# Altium schematic sheet Connectors.SchDoc
size A3
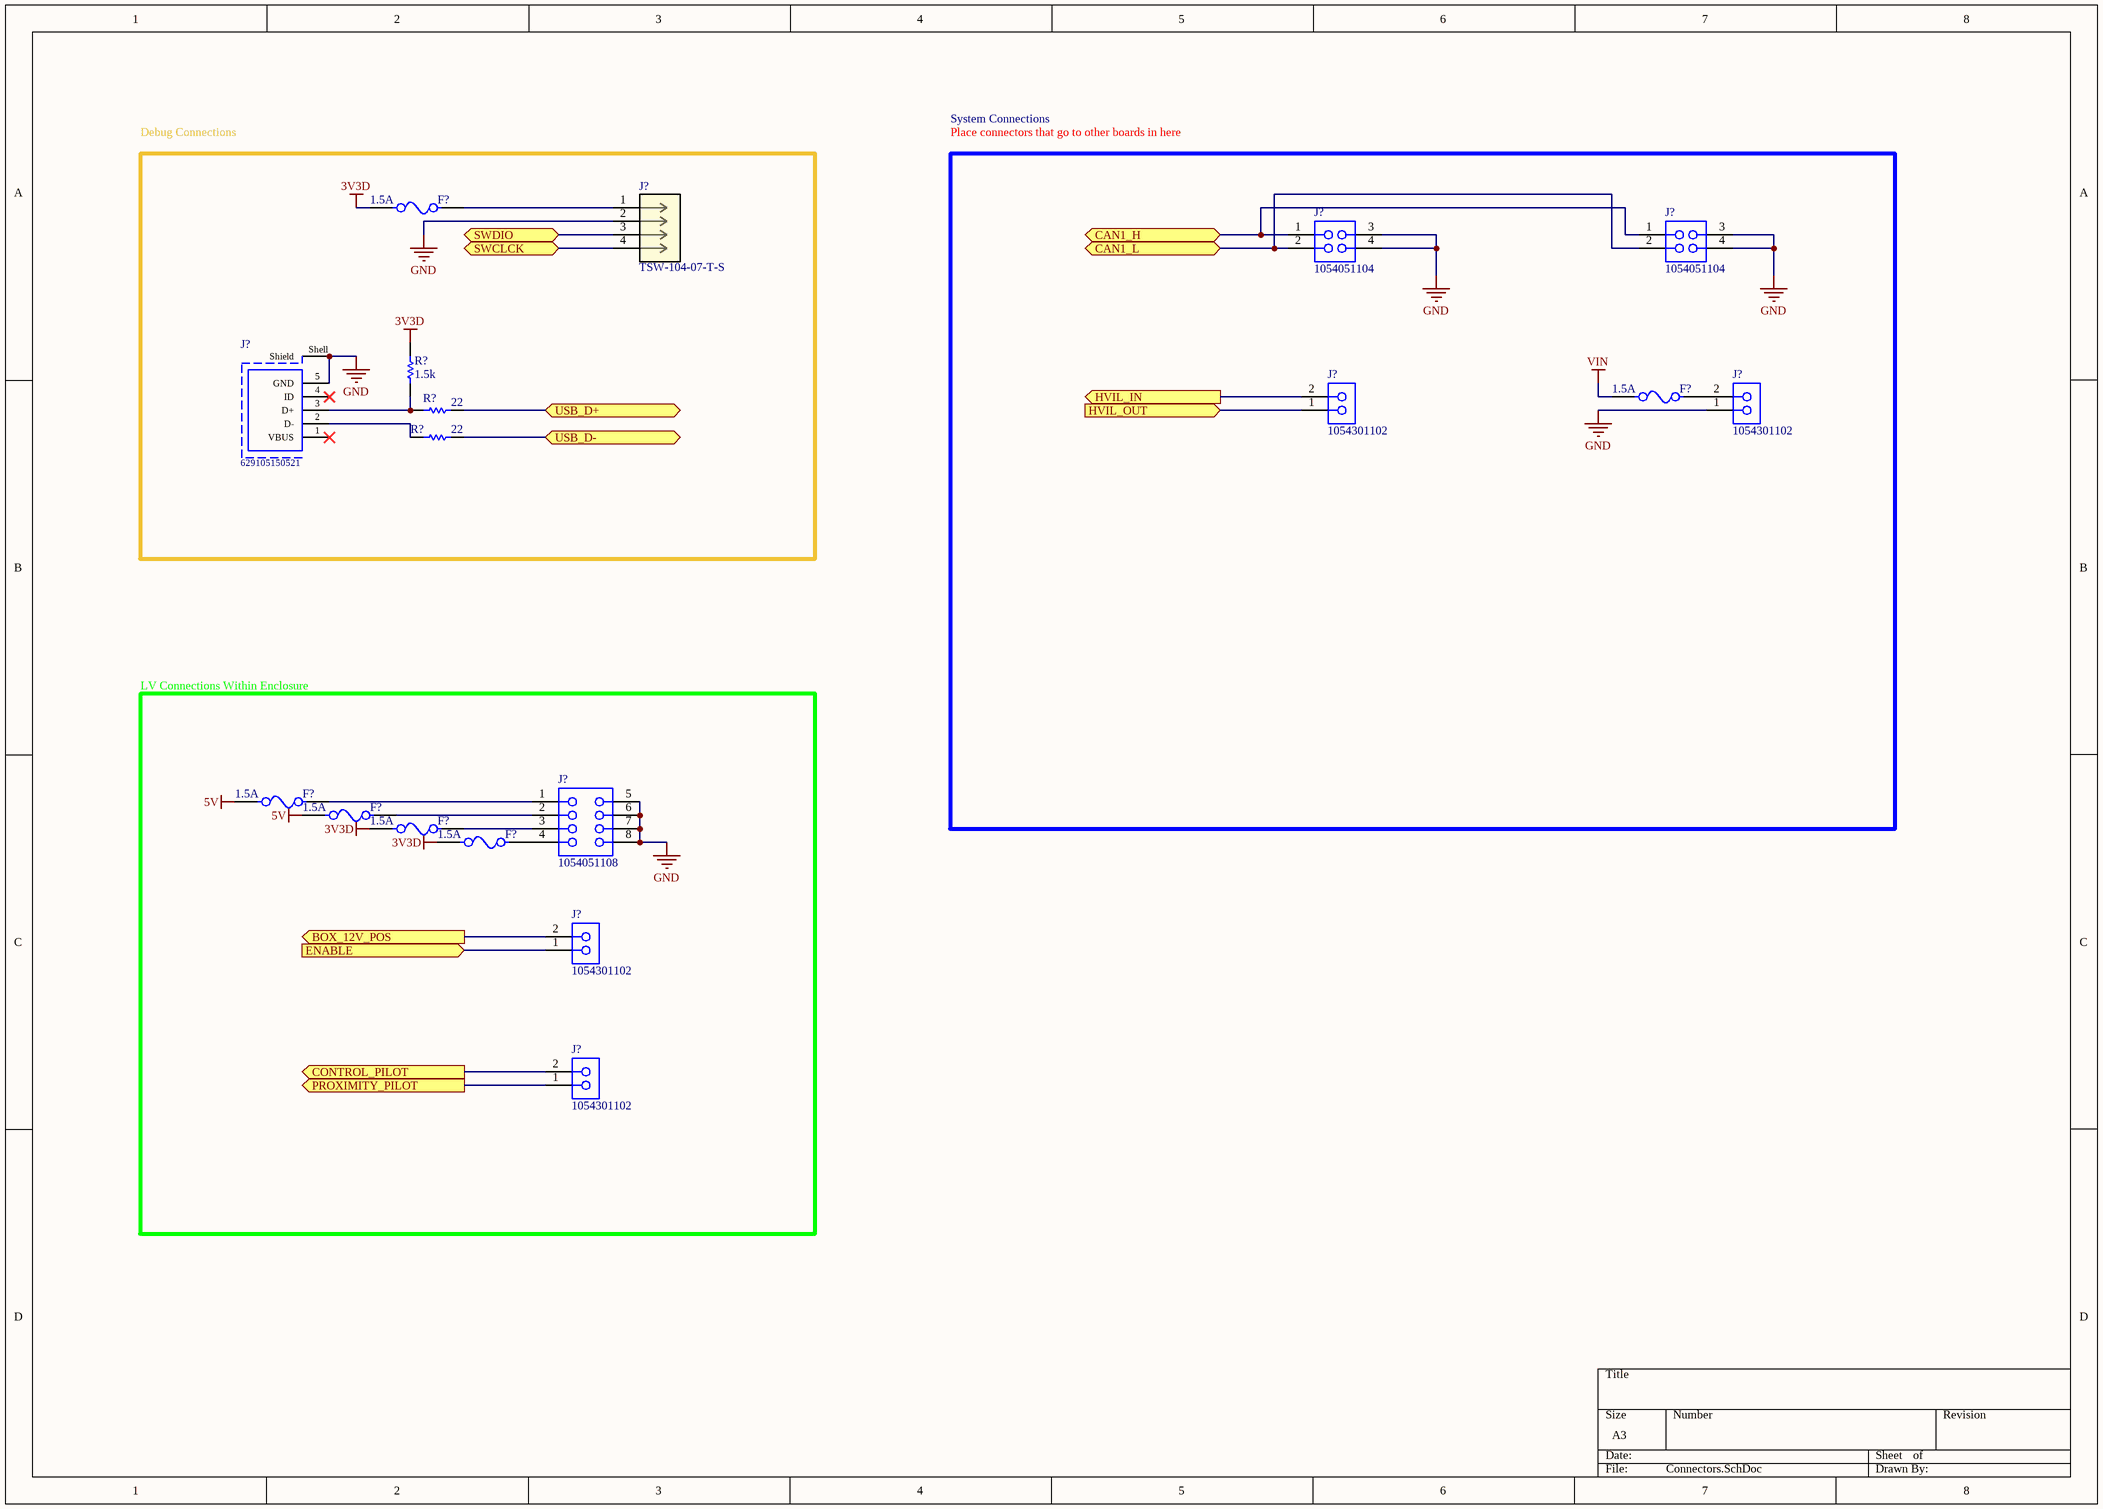
[diagram p0: Connectors.SchDoc]

## Parts
(Parts that share a designator on the sheet are numbered #1, #2 ... from top to bottom, then left to right.)
F?#1  1.5A  [FUSC1608X43N]
F?#2  1.5A  [FUSC1608X43N]
F?#3  1.5A  [FUSC1608X43N]
F?#4  1.5A  [FUSC1608X43N]
F?#5  1.5A  [FUSC1608X43N]
F?#6  1.5A  [FUSC1608X43N]
J?#1  TSW-104-07-T-S  [CON4_1X4_TU_TSW]
J?#2  1054051104  [1054051104]
J?#3  1054051104  [1054051104]
J?#4  1054301102  [1054301102]
J?#5  1054301102  [1054301102]
J?#6  629105150521  [629105150521]
J?#7  1054051108  [1054051108]
J?#8  1054301102  [1054301102]
J?#9  1054301102  [1054301102]
R?#1  1.5k  [RESC2013X50X35ML15T15]
R?#2  22  [RESC0805(2012)_L]
R?#3  22  [RESC2013X50X35ML15T15]

## Blocks framed on the sheet
Debug Connections: F?#1 J?#1 J?#6 R?#1-R?#3
Place connectors that go to other boards in here: F?#2 J?#2-J?#5
LV Connections Within Enclosure: F?#3-F?#6 J?#7-J?#9

## Ports
BOX_12V_POS (out), CAN1_H (bidir), CAN1_L (bidir), CONTROL_PILOT (out), ENABLE (in), HVIL_IN (out), HVIL_OUT (in), PROXIMITY_PILOT (out), SWCLCK (bidir), SWDIO (bidir), USB_D+ (bidir), USB_D- (bidir)

## Nets
3V3D: F?#1.1 F?#5.1 F?#6.1 R?#1.1
5V: F?#3.1 F?#4.1
GND: J?#1.2 J?#2.3 J?#2.4 J?#3.3 J?#3.4 J?#5.1 J?#6.5(GND) J?#6.Shell(Shield) J?#7.5 J?#7.6 J?#7.7 J?#7.8
VIN: F?#2.1
BOX_12V_POS: J?#8.2 ; port BOX_12V_POS
CAN1_H: J?#2.1 J?#3.1 ; port CAN1_H
CAN1_L: J?#2.2 J?#3.2 ; port CAN1_L
CONTROL_PILOT: J?#9.2 ; port CONTROL_PILOT
ENABLE: J?#8.1 ; port ENABLE
HVIL_IN: J?#4.2 ; port HVIL_IN
HVIL_OUT: J?#4.1 ; port HVIL_OUT
PROXIMITY_PILOT: J?#9.1 ; port PROXIMITY_PILOT
SWCLCK: J?#1.4 ; port SWCLCK
SWDIO: J?#1.3 ; port SWDIO
USB_D+: R?#2.1 ; port USB_D+
USB_D-: R?#3.1 ; port USB_D-
NetF?#1_2: F?#1.2 J?#1.1
NetF?#2_2: F?#2.2 J?#5.2
NetF?#3_2: F?#3.2 J?#7.1
NetF?#4_2: F?#4.2 J?#7.2
NetF?#5_2: F?#5.2 J?#7.3
NetF?#6_2: F?#6.2 J?#7.4
NetJ?#6_2: J?#6.2(D-) R?#3.2
NetJ?#6_3: J?#6.3(D+) R?#1.2 R?#2.2

Not connected (* = marked no-connect by the designer): J?#6 1(VBUS)* 4(ID)*

## Notes on the sheet
- System Connections

## Library data of the parts
F?#1-F?#6 = 046701.5NR: 1.5A 0603 Fuse; Manufacturer_Name: LITTELFUSE; Datasheet Link: https://www.littelfuse.com/~/media/electronics/datasheets/fuses/littelfuse_fuse_467_datasheet.pdf.pdf; Height: 0.432mm; Manufacturer_Part_Number: 046701.5NR; Arrow Part Number: 046701.5NR; Arrow Price/Stock: https://www.arrow.com/en/products/046701.5nr/littelfuse; Mouser Part Number: 576-046701.5NR; Mouser Price/Stock: https://www.mouser.com/Search/Refine.aspx?Keyword=576-046701.5NR; Value: 1.5A
J?#1 = TSW-104-07-T-S: 4 Pin Header; Vendor: Samtec Inc; Built_By: EMA_UL_Team; Manufacturer_Part_Number: TSW-104-07-T-S; Copyright: Copyright (C) 2018 Accelerated Designs. All rights reserved; RefDes: RefDes; Type: DEV
J?#2 J?#3 = 1054051104: Nano-Fit Right-Angle Header, Surface Mount, 2.50mm Pitch, Dual Row, 4 Circuits, 0.76µm Tin (Sn) Plating, Black, Glow-Wire Capable; Manufacturer: Molex; Pitch: 2.5 mm; Part Number: 1054051104; ComponentLink2Description: Datasheet; Mounting Technology: Surface Mount; ComponentLink2URL: https://www.molex.com/webdocs/datasheets/pdf/en-us/1054051104_PCB_HEADERS.pdf; Orientation: Right
J?#4 J?#5 J?#8 J?#9 = 1054301102: Nano-Fit Right-Angle Header, Surface Mount, 2.50mm Pitch, Single Row, 2 Circuits, 0.76µm Tin (Sn) Plating, Black, Glow-Wire Capable; Manufacturer: Molex; Pitch: 2.5 mm; Part Number: 1054301102; ComponentLink2Description: Datasheet; Mounting Technology: Surface Mount; ComponentLink2URL: https://www.molex.com/webdocs/datasheets/pdf/en-us/1054301102_PCB_HEADERS.pdf; Orientation: Right
J?#6 = CMP-1502-03252-1: Micro USB 2.0 Type B Receptacle WR-COM, Horizontal, SMT, with Pegs, High Current at Pin 1 & Pin 5; Manufacturer: Wurth Elektronik; Contact Resistance: 30mOhm; Rated Current: 3A; Working Voltage: 30VAC; Package Reference: 629105150521; Mounting Technology: SMT; Connector Type: MicroUSB2.0TypeB; Operating Temperature: -40to85degC; Orientation: Horizontal; Manufacturer URL: http://www.we-online.de; Datasheet URL: https://katalog.we-online.de/em/datasheet/629105150521.pdf; Part Number: 629105150521; Packaging: TapeandReel; Gender: Receptacle; Publisher: WurthElektronik
J?#7 = 1054051108: Nano-Fit Right-Angle Header, Surface Mount, 2.50mm Pitch, Dual Row, 8 Circuits, 0.76µm Tin (Sn) Plating, Black, Glow-Wire Capable; Manufacturer: Molex; Part Number: 1053141108; Pitch: 2.5mm; ComponentLink2URL: https://www.molex.com/webdocs/datasheets/pdf/en-us/1054051108_PCB_HEADERS.pdf; ComponentLink2Description: Datasheet; Orientation: Right; Mounting Technology: Surface Mount
R?#1 = CMP-009-00001-4: Chip Resistor,1.5k Ohm, +/- 1%, 125 mW, -55 to 155 degC, 0805 (2012 Metric); Value: 1.5k
R?#2 = CMP-1013-00736-1: 100K 0.125W 1% 0805 (2012 Metric)  SMD; Value: 22
R?#3 = CMP-009-00001-4: Chip Resistor, 22 Ohm, +/- 1%, 125 mW, -55 to 155 degC, 0805 (2012 Metric); Value: 22